# Altium project BrainBoardProject.PrjPcb
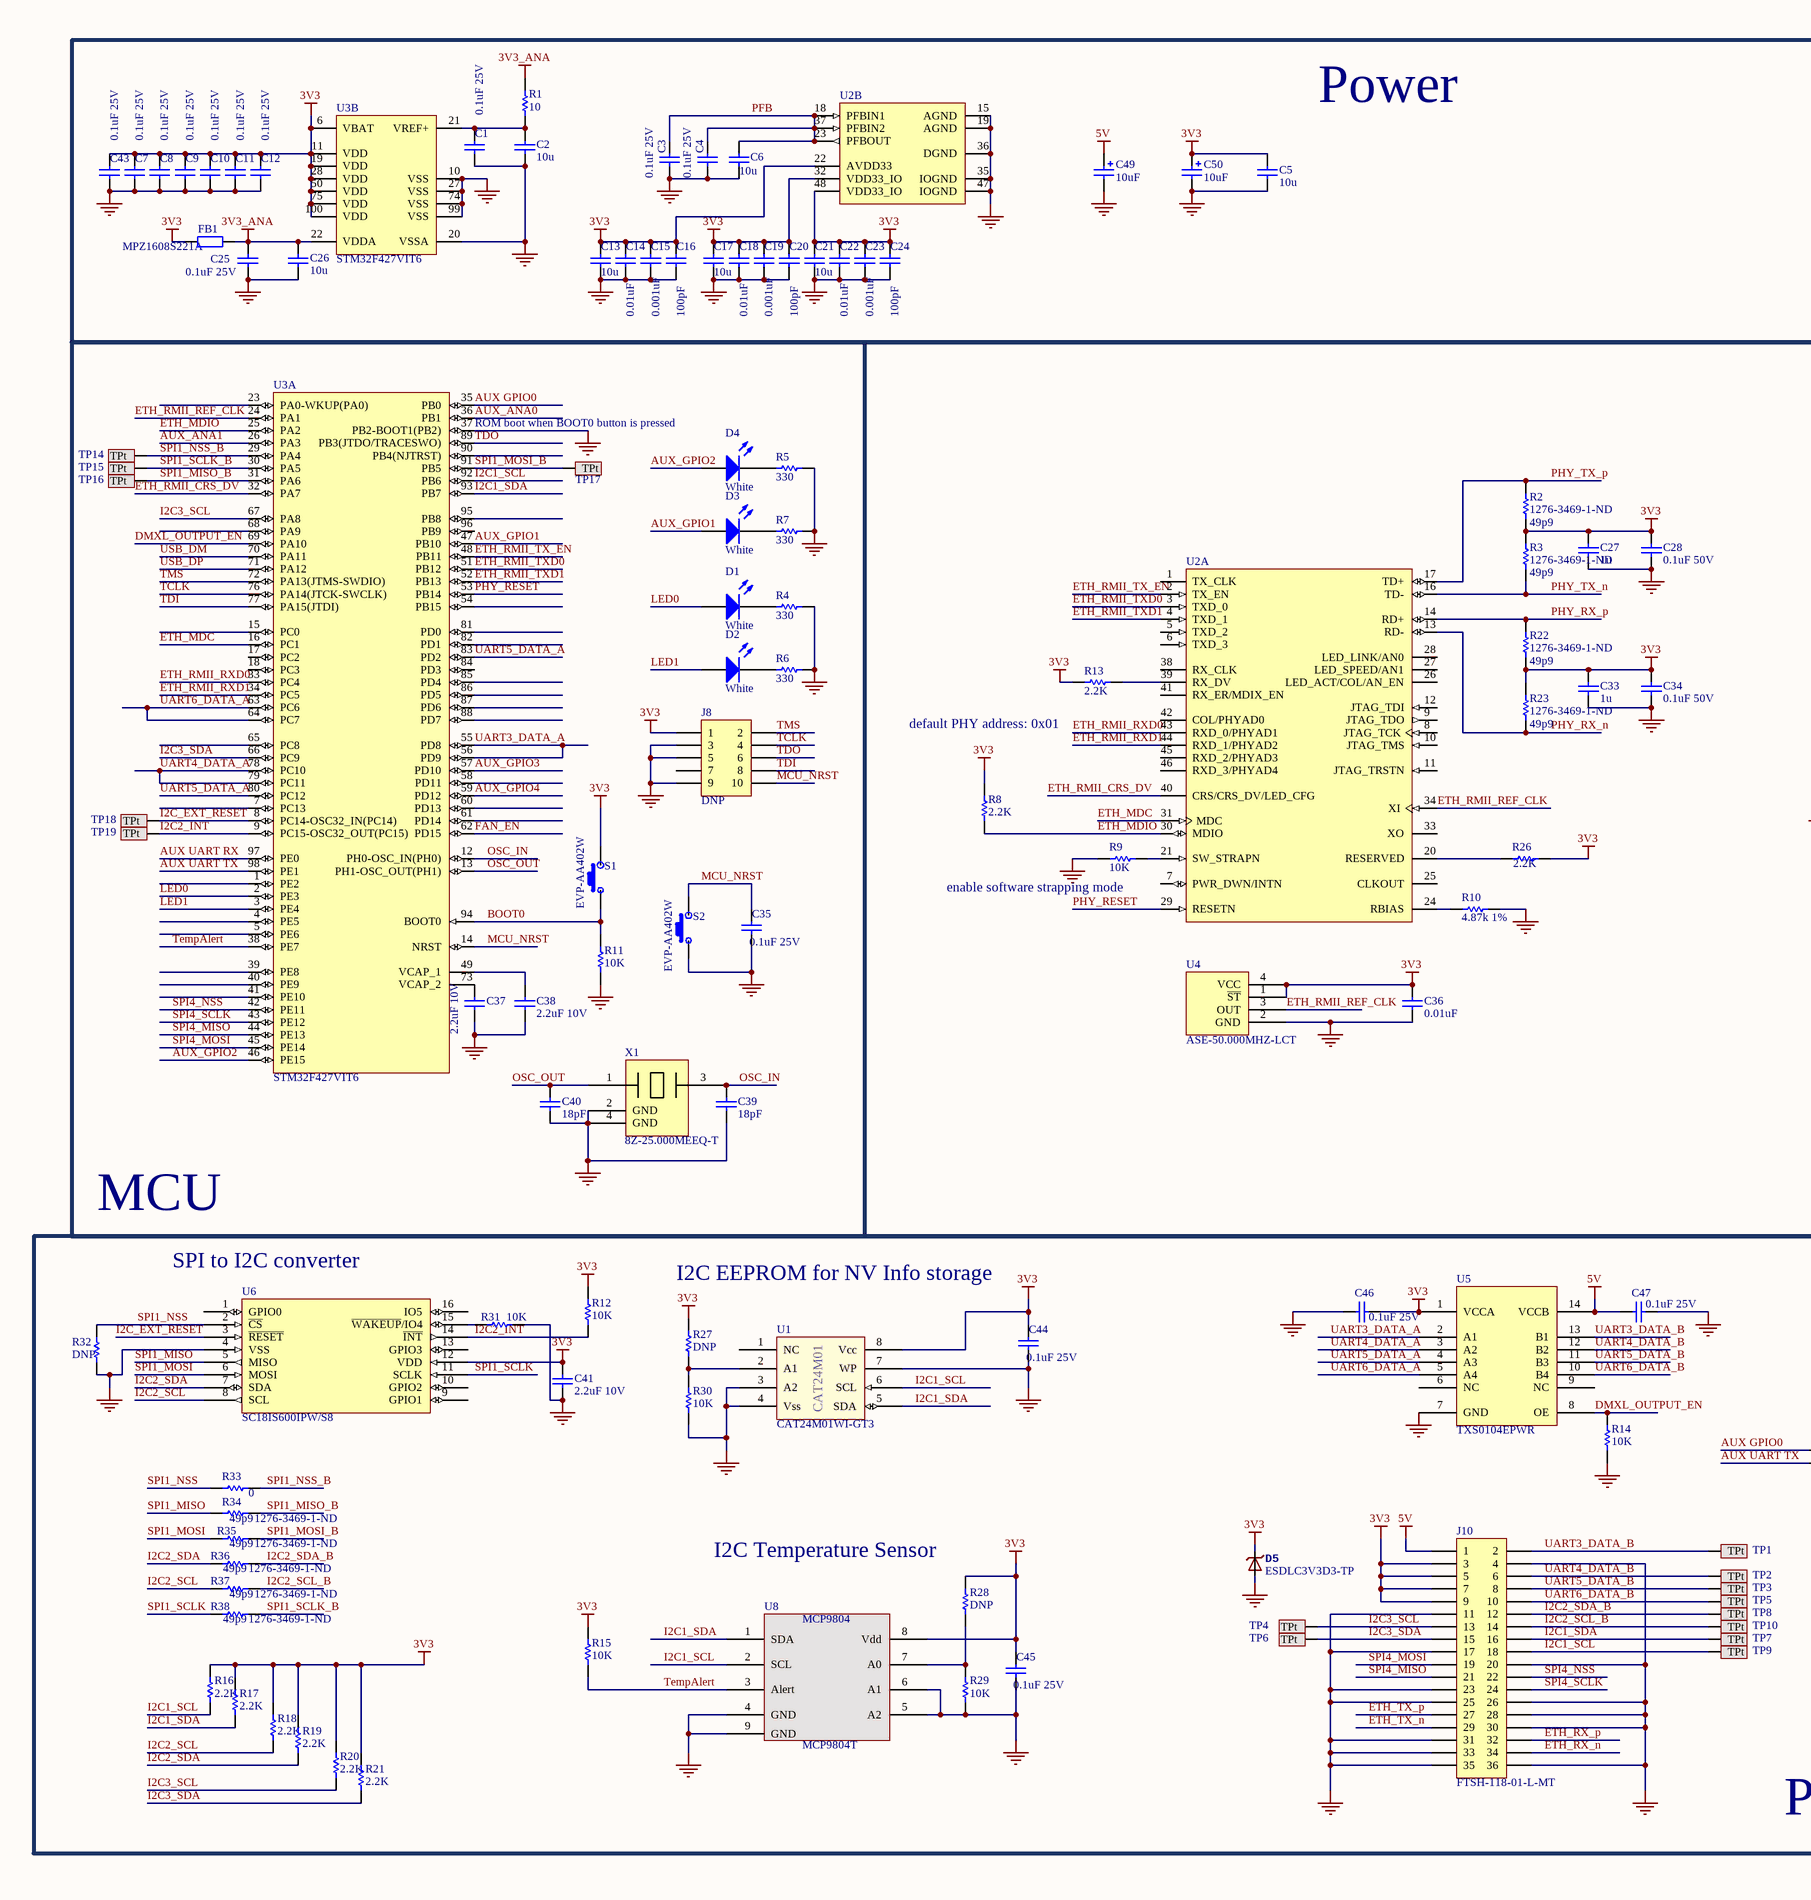
[diagram p0: reflex_brainboard_RevG.SchDoc, left]
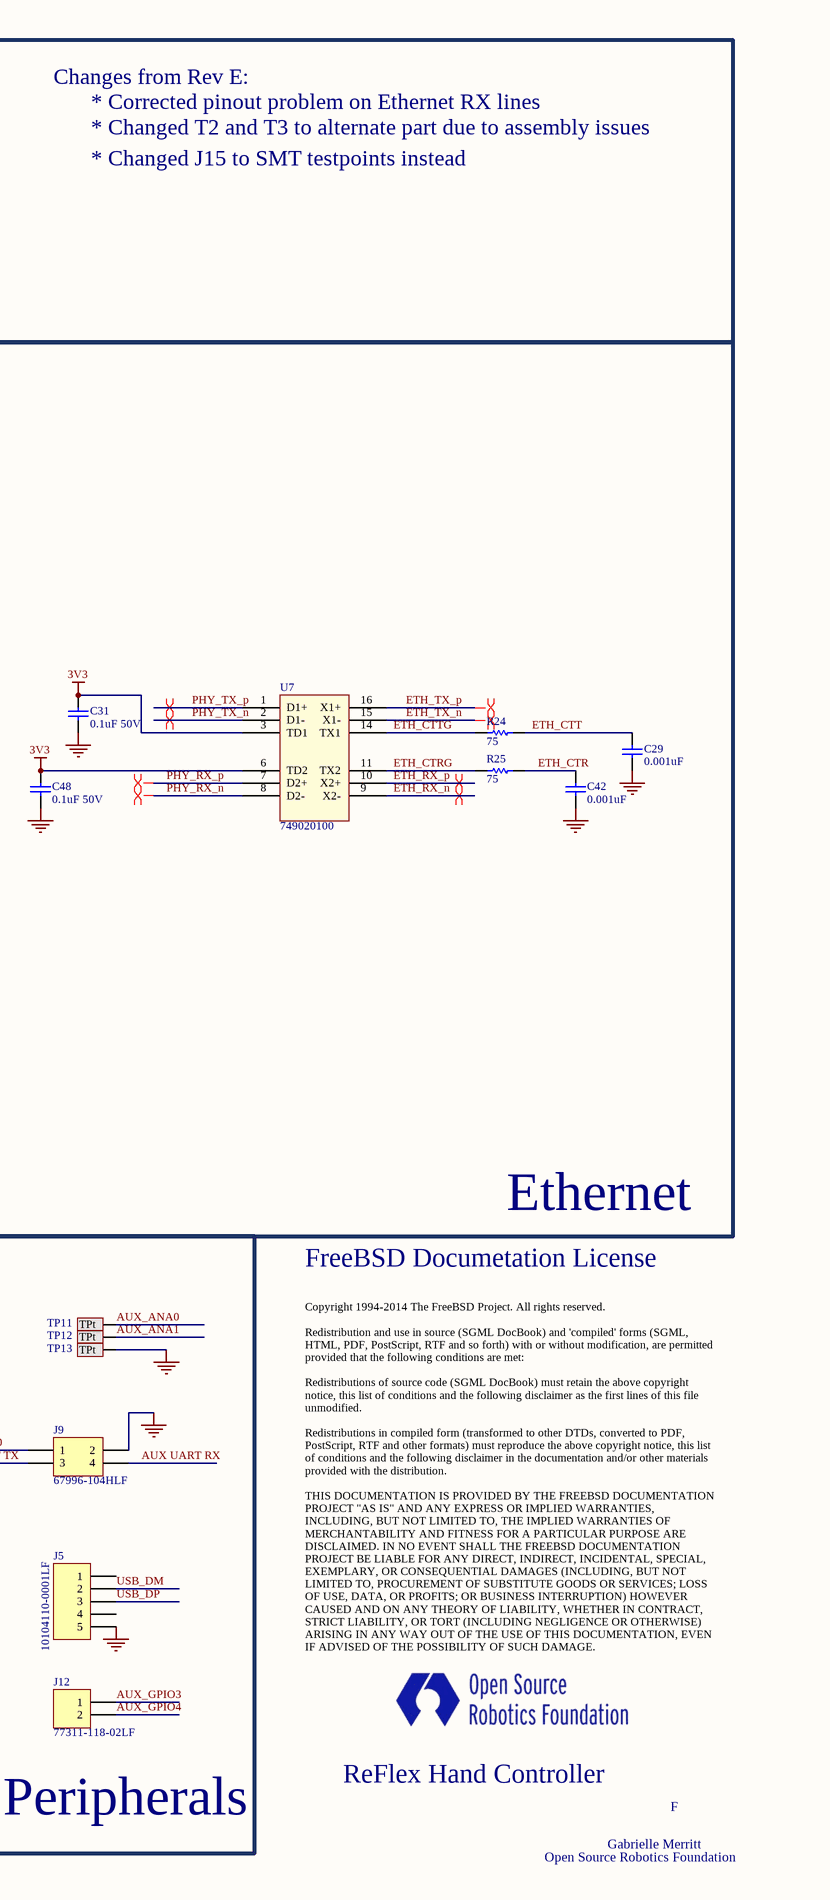
[diagram p1: reflex_brainboard_RevG.SchDoc, right]
1 sheet, 127 parts. Net scope: global (net labels, ports and power ports of the same name join across sheets).
Board file: reflex_brainboard_RevG.PcbDoc

## Sheet reflex_brainboard_RevG.SchDoc
size C; PageSetup: Record=PageOptions|CenterHorizontal=True|CenterVertical=True|PrintScale=0.53|XCorrection=1.00|YCorrection=1.00|PrintKind=0|BorderSize=5000000|LeftOffset=0|BottomOffset=0|Orientation=2|PaperLength=1000|PaperWidth=1000|Scale=100|PaperSource=7|PrintQuality=-4|MediaType=1|DitherType=10|PrintScaleMode=1|PaperKind=Letter|PaperIndex=1

### Parts
C1  0.1uF 25V  [Generic_0603]
C2  value 10u  [GENERIC_0603]  (hidden comment: Cap_0603_10uF)
C3  0.1uF 25V  [Generic_0603]
C4  0.1uF 25V  [Generic_0603]
C5  value 10u  [GENERIC_0603]  (hidden comment: Cap_0603_10uF)
C6  value 10u  [GENERIC_0603]  (hidden comment: Cap_0603_10uF)
C7  0.1uF 25V  [Generic_0603]
C8  0.1uF 25V  [Generic_0603]
C9  0.1uF 25V  [Generic_0603]
C10  0.1uF 25V  [Generic_0603]
C11  0.1uF 25V  [Generic_0603]
C12  0.1uF 25V  [Generic_0603]
C13  value 10u  [GENERIC_0603]  (hidden comment: Cap_0603_10uF)
C14  0.01uF  [Generic_0402]
C15  0.001uF  [Generic_0402]
C16  100pF  [Generic_0402]
C17  value 10u  [GENERIC_0603]  (hidden comment: Cap_0603_10uF)
C18  0.01uF  [Generic_0402]
C19  0.001uF  [Generic_0402]
C20  100pF  [Generic_0402]
C21  value 10u  [GENERIC_0603]  (hidden comment: Cap_0603_10uF)
C22  0.01uF  [Generic_0402]
C23  0.001uF  [Generic_0402]
C24  100pF  [Generic_0402]
C25  0.1uF 25V  [Generic_0603]
C26  value 10u  [GENERIC_0603]  (hidden comment: Cap_0603_10uF)
C27  1u  [Generic_0402]
C28  value 0.1uF 50V  [Generic_0402]  (hidden comment: 0.1uF)
C29  0.001uF  [Generic_0402]
C31  value 0.1uF 50V  [Generic_0402]  (hidden comment: 0.1uF)
C33  1u  [Generic_0402]
C34  value 0.1uF 50V  [Generic_0402]  (hidden comment: 0.1uF)
C35  0.1uF 25V  [Generic_0603]
C36  0.01uF  [Generic_0402]
C37  2.2uF 10V  [Generic_0603]
C38  2.2uF 10V  [Generic_0603]
C39  18pF  [Generic_0402]
C40  18pF  [Generic_0402]
C41  2.2uF 10V  [Generic_0603]
C42  0.001uF  [Generic_0402]
C43  0.1uF 25V  [Generic_0603]
C44  0.1uF 25V  [Generic_0603]
C45  0.1uF 25V  [Generic_0603]
C46  0.1uF 25V  [Generic_0603]
C47  0.1uF 25V  [Generic_0603]
C48  value 0.1uF 50V  [Generic_0402]  (hidden comment: 0.1uF)
C49  10uF  [GENERIC_0805P]
C50  10uF  [GENERIC_0805P]
D1  value White  [0402_LED_WHITE]  (hidden comment: LED White)
D2  value White  [0402_LED_WHITE]  (hidden comment: LED White)
D3  value White  [0402_LED_WHITE]  (hidden comment: LED White)
D4  value White  [0402_LED_WHITE]  (hidden comment: LED White)
D5  ESDLC3V3D3-TP  [SOD-323]
FB1  MPZ1608S221A  [GENERIC_0603]
J5  10104110-0001LF  [FCI-10104110]
J8  DNP  [CNCTECH_3220-10-0300-00]
J9  67996-104HLF  [HDR2X2]
J10  FTSH-118-01-L-MT  [FTSH-118-01-L-MT]
J12  77311-118-02LF  [HDR1X2]
R1  10  [Generic_0402]
R2  value 49p9  Supplier Part Number 1: 1276-3469-1-ND  [Generic_0402]  (hidden comment: Res_0402_49p9_1pct)
R3  value 49p9  Supplier Part Number 1: 1276-3469-1-ND  [Generic_0402]  (hidden comment: Res_0402_49p9_1pct)
R4  330  [Generic_0402]
R5  330  [Generic_0402]
R6  330  [Generic_0402]
R7  330  [Generic_0402]
R8  value 2.2K  [Generic_0402]  (hidden comment: Res_0402_2.2K)
R9  value 10K  [Generic_0402]  (hidden comment: Res_0402_10K_1pct)
R10  4.87k 1%  [Generic_0402]
R11  value 10K  [Generic_0402]  (hidden comment: Res_0402_10K_1pct)
R12  value 10K  [Generic_0402]  (hidden comment: Res_0402_10K_1pct)
R13  value 2.2K  [Generic_0402]  (hidden comment: Res_0402_2.2K)
R14  value 10K  [Generic_0402]  (hidden comment: Res_0402_10K_1pct)
R15  value 10K  [Generic_0402]  (hidden comment: Res_0402_10K_1pct)
R16  value 2.2K  [Generic_0402]  (hidden comment: Res_0402_2.2K)
R17  value 2.2K  [Generic_0402]  (hidden comment: Res_0402_2.2K)
R18  value 2.2K  [Generic_0402]  (hidden comment: Res_0402_2.2K)
R19  value 2.2K  [Generic_0402]  (hidden comment: Res_0402_2.2K)
R20  value 2.2K  [Generic_0402]  (hidden comment: Res_0402_2.2K)
R21  value 2.2K  [Generic_0402]  (hidden comment: Res_0402_2.2K)
R22  value 49p9  Supplier Part Number 1: 1276-3469-1-ND  [Generic_0402]  (hidden comment: Res_0402_49p9_1pct)
R23  value 49p9  Supplier Part Number 1: 1276-3469-1-ND  [Generic_0402]  (hidden comment: Res_0402_49p9_1pct)
R24  75  [Generic_0402]
R25  75  [Generic_0402]
R26  value 2.2K  [Generic_0402]  (hidden comment: Res_0402_2.2K)
R27  value DNP  [Generic_0402]  (hidden comment: Res_0402_DNP)
R28  value DNP  [Generic_0402]  (hidden comment: Res_0402_DNP)
R29  value 10K  [Generic_0402]  (hidden comment: Res_0402_10K_1pct)
R30  value 10K  [Generic_0402]  (hidden comment: Res_0402_10K_1pct)
R31  value 10K  [Generic_0402]  (hidden comment: Res_0402_10K_1pct)
R32  value DNP  [Generic_0402]  (hidden comment: Res_0402_DNP)
R33  value 0  [GENERIC_0402]  (hidden comment: Res_0402_0)
R34  value 49p9  Supplier Part Number 1: 1276-3469-1-ND  [Generic_0402]  (hidden comment: Res_0402_49p9_1pct)
R35  value 49p9  Supplier Part Number 1: 1276-3469-1-ND  [Generic_0402]  (hidden comment: Res_0402_49p9_1pct)
R36  value 49p9  Supplier Part Number 1: 1276-3469-1-ND  [Generic_0402]  (hidden comment: Res_0402_49p9_1pct)
R37  value 49p9  Supplier Part Number 1: 1276-3469-1-ND  [Generic_0402]  (hidden comment: Res_0402_49p9_1pct)
R38  value 49p9  Supplier Part Number 1: 1276-3469-1-ND  [Generic_0402]  (hidden comment: Res_0402_49p9_1pct)
S1  EVP-AA402W  [EVPAA402_switch]
S2  EVP-AA402W  [EVPAA402_switch]
TP1  SMT Pad  [TP_PAD_20mil]  (value not drawn)
TP2  SMT Pad  [TP_PAD_20mil]  (value not drawn)
TP3  SMT Pad  [TP_PAD_20mil]  (value not drawn)
TP4  SMT Pad  [TP_PAD_20mil]  (value not drawn)
TP5  SMT Pad  [TP_PAD_20mil]  (value not drawn)
TP6  SMT Pad  [TP_PAD_20mil]  (value not drawn)
TP7  SMT Pad  [TP_PAD_20mil]  (value not drawn)
TP8  SMT Pad  [TP_PAD_20mil]  (value not drawn)
TP9  SMT Pad  [TP_PAD_20mil]  (value not drawn)
TP10  SMT Pad  [TP_PAD_20mil]  (value not drawn)
TP11  SMT Pad  [TP_PAD_20mil]  (value not drawn)
TP12  SMT Pad  [TP_PAD_20mil]  (value not drawn)
TP13  SMT Pad  [TP_PAD_20mil]  (value not drawn)
TP14  SMT Pad  [TP_PAD_20mil]  (value not drawn)
TP15  SMT Pad  [TP_PAD_20mil]  (value not drawn)
TP16  SMT Pad  [TP_PAD_20mil]  (value not drawn)
TP17  SMT Pad  [TP_PAD_20mil]  (value not drawn)
TP18  SMT Pad  [TP_PAD_20mil]  (value not drawn)
TP19  SMT Pad  [TP_PAD_20mil]  (value not drawn)
U1  CAT24M01WI-GT3  [SOIC8]
U2  TLK110PT  [PT0048A_M]  (value not drawn)  (parts A,B of 2)
U3  STM32F427VIT6  [STM-LQFP100_N]  (parts A,B of 2)
U4  ASE-50.000MHZ-LCT  [OSCILLATOR_3.2x2.5]
U5  TXS0104EPWR  [TXS0104EPWR]
U6  SC18IS600IPW/S8  [SOT403-1-TSSOP16]
U7  749020100  [Wurth749020100]
U8  MCP9804T  [Temp_MCP9804T]
X1  8Z-25.000MEEQ-T  [CRYSTAL_2_2.5]

### Blocks framed on the sheet
Power: C1-C26 C43 C49 C50 FB1 R1 U2 U3
Ethernet: C27-C29 C31 C33 C34 C36 C42 C48 R2 R3 R8-R10 R13 R22-R26 U2 U4 U7
MCU: C35 C37-C40 D1-D4 J8 R4-R7 R11 S1 S2 TP14-TP19 U3 X1
Peripherals: C41 C44-C47 D5 J5 J9 J10 J12 R12 R14-R21 R27-R38 TP1-TP13 U1 U5 U6 U8

### Nets
3V3: C5.2 C7.2 C8.2 C9.2 C10.2 C11.2 C12.2 C13.2 C14.2 C15.2 C16.2 C17.2 C18.2 C19.2 C20.2 C21.2 C22.2 C23.2 C24.2 C27.2 C28.2 C31.2 C33.2 C34.2 C36.2 C41.2 C43.2 C44.2 C45.2 C46.1 C48.2 C50.1 D5.1(A) FB1.1 J8.1 J10.3 J10.5 J10.7 J10.9 R2.2 R3.2 R8.1 R12.2 R13.2 R15.2 R16.2 R17.2 R18.2 R19.2 R20.2 R21.2 R22.1 R23.2 R26.2 R27.2 R28.2 S1.1 U1.8(Vcc) U2.22(AVDD33) U2.32(VDD33_IO) U2.48(VDD33_IO) U3.6(VBAT) U3.11(VDD) U3.19(VDD) U3.28(VDD) U3.50(VDD) U3.75(VDD) U3.100(VDD) U4.1(~{ST}) U4.4(VCC) U5.1(VCCA) U6.12(VDD) U7.3(TD1) U7.6(TD2) U8.8(Vdd)
3V3_ANA: C25.2 C26.2 FB1.2 R1.2 U3.22(VDDA)
5V: C47.2 C49.1 J10.1 U5.14(VCCB)
GND: C1.1 C2.1 C3.2 C4.1 C5.1 C6.1 C7.1 C8.1 C9.1 C10.1 C11.1 C12.1 C13.1 C14.1 C15.1 C16.1 C17.1 C18.1 C19.1 C20.1 C21.1 C22.1 C23.1 C24.1 C25.1 C26.1 C27.1 C28.1 C29.1 C31.1 C33.1 C34.1 C35.1 C36.1 C37.1 C38.1 C39.2 C40.2 C41.1 C42.1 C43.1 C44.1 C45.1 C46.2 C47.1 C48.1 C49.2 C50.2 D5.2(C) J5.5 J8.3 J8.5 J8.9 J9.2 J10.4 J10.11 J10.17 J10.20 J10.23 J10.25 J10.26 J10.28 J10.30 J10.31 J10.33 J10.35 J10.36 R4.1 R5.1 R6.1 R7.1 R9.1 R10.1 R11.1 R14.1 R29.1 R30.1 R31.1 R32.2 S2.2 TP13.1(TPt) U1.3(A2) U1.4(Vss) U1.7(WP) U2.15(AGND) U2.19(AGND) U2.35(IOGND) U2.36(DGND) U2.47(IOGND) U3.10(VSS) U3.20(VSSA) U3.27(VSS) U3.37(PB2-BOOT1(PB2)) U3.74(VSS) U3.99(VSS) U4.2(GND) U5.7(GND) U6.4(VSS) U8.4(GND) U8.5(A2) U8.6(A1) U8.9(GND) X1.2(GND) X1.4(GND)
AUX GPIO0: J9.1 U3.35(PB0)
AUX UART RX: J9.4 U3.97(PE0)
AUX UART TX: J9.3 U3.98(PE1)
AUX_ANA0: TP11.1(TPt) U3.36(PB1)
AUX_ANA1: TP12.1(TPt) U3.26(PA3)
AUX_GPIO1: D3.1(A) U3.47(PB10)
AUX_GPIO2: D4.1(A) U3.46(PE15)
AUX_GPIO3: J12.1 U3.57(PD10)
AUX_GPIO4: J12.2 U3.59(PD12)
BOOT0: R11.2 S1.2 U3.94(BOOT0)
DMXL_OUTPUT_EN: R14.2 U3.69(PA10) U5.8(OE)
ETH_CTR: C42.2 R25.2
ETH_CTRG: R25.1 U7.11(TX2)
ETH_CTT: C29.2 R24.2
ETH_CTTG: R24.1 U7.14(TX1)
ETH_MDC: U2.31(MDC) U3.16(PC1)
ETH_MDIO: R8.2 U2.30(MDIO) U3.25(PA2)
ETH_RMII_CRS_DV: U2.40(CRS/CRS_DV/LED_CFG) U3.32(PA7)
ETH_RMII_REF_CLK: U2.34(XI) U3.24(PA1) U4.3(OUT)
ETH_RMII_RXD0: U2.43(RXD_0/PHYAD1) U3.33(PC4)
ETH_RMII_RXD1: U2.44(RXD_1/PHYAD2) U3.34(PC5)
ETH_RMII_TX_EN: U2.2(TX_EN) U3.48(PB11)
ETH_RMII_TXD0: U2.3(TXD_0) U3.51(PB12)
ETH_RMII_TXD1: U2.4(TXD_1) U3.52(PB13)
ETH_RX_n: J10.34 U7.9(X2-)
ETH_RX_p: J10.32 U7.10(X2+)
ETH_TX_n: J10.29 U7.15(X1-)
ETH_TX_p: J10.27 U7.16(X1+)
FAN_EN: U3.62(PD15)
I2C1_SCL: J10.18 R16.1 TP9.1(TPt) U1.6(SCL) U3.92(PB6) U8.2(SCL)
I2C1_SDA: J10.16 R17.1 TP7.1(TPt) U1.5(SDA) U3.93(PB7) U8.1(SDA)
I2C2_INT: R12.1 TP19.1(TPt) U3.9(PC15-OSC32_OUT(PC15)) U6.14(~{INT})
I2C2_SCL: R18.1 R37.2 U6.8(SCL)
I2C2_SCL_B: J10.14 R37.1 TP10.1(TPt)
I2C2_SDA: R19.1 R36.2 U6.7(SDA)
I2C2_SDA_B: J10.12 R36.1 TP8.1(TPt)
I2C3_SCL: J10.13 R20.1 TP4.1(TPt) U3.67(PA8)
I2C3_SDA: J10.15 R21.1 TP6.1(TPt) U3.66(PC9)
I2C_EXT_~{RESE}T: TP18.1(TPt) U3.8(PC14-OSC32_IN(PC14)) U6.3(~{RESET})
LED0: D1.1(A) U3.2(PE3)
LED1: D2.1(A) U3.3(PE4)
MCU_NRST: C35.2 J8.10 S2.1 U3.14(NRST)
OSC_IN: C39.1 U3.12(PH0-OSC_IN(PH0)) X1.3
OSC_OUT: C40.1 U3.13(PH1-OSC_OUT(PH1)) X1.1
PFB: C3.1 C4.2 C6.2 U2.18(PFBIN1) U2.23(PFBOUT) U2.37(PFBIN2)
PHY_RESET: U2.29(RESETN) U3.53(PB14)
PHY_RX_n: R23.1 U2.13(RD-) U7.8(D2-)
PHY_RX_p: R22.2 U2.14(RD+) U7.7(D2+)
PHY_TX_n: R3.1 U2.16(TD-) U7.2(D1-)
PHY_TX_p: R2.1 U2.17(TD+) U7.1(D1+)
SPI1_MISO: R34.2 U6.5(MISO)
SPI1_MISO_B: R34.1 TP16.1(TPt) U3.31(PA6)
SPI1_MOSI: R35.2 U6.6(MOSI)
SPI1_MOSI_B: R35.1 TP17.1(TPt) U3.91(PB5)
SPI1_NSS: R32.1 R33.2 U6.2(~{CS})
SPI1_NSS_B: R33.1 TP14.1(TPt) U3.29(PA4)
SPI1_SCLK: R38.2 U6.11(SCLK)
SPI1_SCLK_B: R38.1 TP15.1(TPt) U3.30(PA5)
SPI4_MISO: J10.21 U3.44(PE13)
SPI4_MOSI: J10.19 U3.45(PE14)
SPI4_NSS: J10.22 U3.42(PE11)
SPI4_SCLK: J10.24 U3.43(PE12)
TCLK: J8.4 U3.76(PA14(JTCK-SWCLK))
TDI: J8.8 U3.77(PA15(JTDI))
TDO: J8.6 U3.89(PB3(JTDO/TRACESWO))
TempAlert: R15.1 U3.38(PE7) U8.3(Alert)
TMS: J8.2 U3.72(PA13(JTMS-SWDIO))
UART3_DATA_A: U3.55(PD8) U3.56(PD9) U5.2(A1)
UART3_DATA_B: J10.2 TP1.1(TPt) U5.13(B1)
UART4_DATA_A: U3.78(PC10) U3.79(PC11) U5.3(A2)
UART4_DATA_B: J10.6 TP2.1(TPt) U5.12(B2)
UART5_DATA_A: U3.80(PC12) U3.83(PD2) U5.4(A3)
UART5_DATA_B: J10.8 TP3.1(TPt) U5.11(B3)
UART6_DATA_A: U3.63(PC6) U3.64(PC7) U5.5(A4)
UART6_DATA_B: J10.10 TP5.1(TPt) U5.10(B4)
USB_DM: J5.2 U3.70(PA11)
USB_DP: J5.3 U3.71(PA12)
NetC1_2: C1.2 C2.2 R1.1 U3.21(VREF+)
NetC37_2: C37.2 U3.73(VCAP_2)
NetC38_2: C38.2 U3.49(VCAP_1)
NetD1_2: D1.2(K) R4.2
NetD2_2: D2.2(K) R6.2
NetD3_2: D3.2(K) R7.2
NetD4_2: D4.2(K) R5.2
NetR9_2: R9.2 U2.21(SW_STRAPN)
NetR10_2: R10.2 U2.24(RBIAS)
NetR13_1: R13.1 U2.39(RX_DV)
NetR26_1: R26.1 U2.20(RESERVED)
NetR27_1: R27.1 R30.2 U1.2(A1)
NetR28_1: R28.1 R29.2 U8.7(A0)
NetR31_2: R31.2 U6.15(~{WAKEUP}/IO4)

Not connected (* = marked no-connect by the designer): J5 1 4; J8 7; U1 1(NC); U2 1(TX_CLK) 5(TXD_2) 6(TXD_3) 7(PWR_DWN/INTN) 8(JTAG_TCK) 9(JTAG_TDO) 10(JTAG_TMS) 11(JTAG_TRSTN) 12(JTAG_TDI) 25(CLKOUT) 26(LED_ACT/COL/AN_EN) 27(LED_SPEED/AN1) 28(LED_LINK/AN0) 33(XO) 38(RX_CLK) 41(RX_ER/MDIX_EN) 42(COL/PHYAD0) 45(RXD_2/PHYAD3) 46(RXD_3/PHYAD4); U3 1(PE2) 4(PE5) 5(PE6) 7(PC13) 15(PC0) 17(PC2) 18(PC3) 23(PA0-WKUP(PA0)) 39(PE8) 40(PE9) 41(PE10) 54(PB15) 58(PD11) 60(PD13) 61(PD14) 65(PC8) 68(PA9) 81(PD0) 82(PD1) 84(PD3) 85(PD4) 86(PD5) 87(PD6) 88(PD7) 90(PB4(NJTRST)) 95(PB8) 96(PB9); U5 6(NC) 9(NC); U6 1(GPIO0) 9(GPIO1) 10(GPIO2) 13(GPIO3) 16(IO5)

### Layout directives
differential pair: ETH_RX_n, ETH_RX_p, ETH_TX_n, ETH_TX_p, PHY_RX_n, PHY_RX_p, PHY_TX_n, PHY_TX_p

### Notes on the sheet
- Changes from Rev E:
- * Corrected pinout problem on Ethernet RX lines
- * Changed T2 and T3 to alternate part due to assembly issues
- * Changed J15 to SMT testpoints instead
- ROM boot when BOOT0 button is pressed
- (near R13) default PHY address: 0x01
- enable software strapping mode
- (near U6) SPI to I2C converter
- I2C EEPROM for NV Info storage
- FreeBSD Documetation License
- (near R28) I2C Temperature Sensor
- Copyright 1994-2014 The FreeBSD Project. All rights reserved.
  Redistribution and use in source (SGML DocBook) and 'compiled' forms (SGML, HTML, PDF, PostScript, RTF and so forth) with or without modification, are permitted provided that the following conditions are met:
  Redistributions of source code (SGML DocBook) must retain the above copyright notice, this list of conditions and the following disclaimer as the first lines of this file unmodified.
  Redistributions in compiled form (transformed to other DTDs, converted to PDF, PostScript, RTF and other formats) must reproduce the above copyright notice, this list of conditions and the following disclaimer in the documentation and/or other materials provided with the distribution.
  THIS DOCUMENTATION IS PROVIDED BY THE FREEBSD DOCUMENTATION PROJECT "AS IS" AND ANY EXPRESS OR IMPLIED WARRANTIES, INCLUDING, BUT NOT LIMITED TO, THE IMPLIED WARRANTIES OF MERCHANTABILITY AND FITNESS FOR A PARTICULAR PURPOSE ARE DISCLAIMED. IN NO EVENT SHALL THE FREEBSD DOCUMENTATION PROJECT BE LIABLE FOR ANY DIRECT, INDIRECT, INCIDENTAL, SPECIAL, EXEMPLARY, OR CONSEQUENTIAL DAMAGES (INCLUDING, BUT NOT LIMITED TO, PROCUREMENT OF SUBSTITUTE GOODS OR SERVICES; LOSS OF USE, DATA, OR PROFITS; OR BUSINESS INTERRUPTION) HOWEVER CAUSED AND ON ANY THEORY OF LIABILITY, WHETHER IN CONTRACT, STRICT LIABILITY, OR TORT (INCLUDING NEGLIGENCE OR OTHERWISE) ARISING IN ANY WAY OUT OF THE USE OF THIS DOCUMENTATION, EVEN IF ADVISED OF THE POSSIBILITY OF SUCH DAMAGE.
- ReFlex Hand Controller
- Gabrielle Merritt
- F
- Open Source Robotics Foundation
- (in symbol IC_EEPROM_I2C_1Mbit) CAT24M01
- (in symbol IC_Temp_Sensor_MCP9804_I2C) MCP9804

### Library data of the parts
C1 C3 C4 C7-C12 C25 C35 C43-C47 = Cap_0603_0.1uF_25V: Capacitor 0.1uF 0603 package; Supplier 1: Digi-Key; Supplier Part Number 1: 478-1244-1-ND; Supplier Unit Price 1: 0.38; Supplier Unit Price 2: 0.13; Value: 0.1uF 25V
C2 C5 C6 C13 C17 C21 C26 = Cap_0603_10uF: Capacitor; Manufacturer: TDK Corporation; Manufacturer Part Number: C1608X5R1E106M080AC; Case-EIA: 0603; PackageReference: 0603; Mouser: 810-C1608X5R1E106M; Supplier 1: Digi-Key; Supplier 2: Mouser; Supplier Part Number 1: 445-9015-1-ND; Supplier Part Number 2: 810-C1608X5R1E106M
C14 C18 C22 C36 = Cap_0402_0p01uF: Capacitor 0.01uF 0402 package; Supplier 1: Digi-Key; Supplier Part Number 1: 445-1262-1-ND; Supplier Unit Price 1: 0.018; Supplier Unit Price 2: 0.006; Value: 0.01uF
C15 C19 C23 C29 C42 = Cap_0402_0p001uF: Capacitor 0.001uF 0402 package; Supplier 1: Digi-Key; Supplier 2: Newark; Supplier Part Number 1: 311-1036-1-ND; Supplier Part Number 2: 74C3082; Value: 0.001uF
C16 C20 C24 = Cap_0402_100pF: Capacitor 100pF 0402 package; Supplier 1: Digi-Key; Supplier Part Number 1: 490-3458-1-ND; Supplier Unit Price 1: 0.01; Supplier Unit Price 2: 0.00526; Value: 100pF
C27 C33 = Cap_0402_1uF: Capacitor; Supplier 1: Digi-Key; Supplier 2: Mouser; Supplier Part Number 1: 445-4978-1-ND; Supplier Part Number 2: 810-C1005X5R1C105K; Value: 1u
C28 C31 C34 C48 = Cap_0402_0p1uF_50V: Capacitor 0.1uF 0402 package; Supplier 1: Digi-Key; Supplier 2: Newark; Supplier Part Number 1: 445-5933-1-ND; Supplier Part Number 2: 12T1864
C37 C38 C41 = Cap_0603_2p2uF_10V: Capacitor 2.2uF 0603 package; Supplier 1: Digi-Key; Supplier 2: Newark; Supplier Part Number 1: 587-1253-1-ND; Supplier Part Number 2: 18J2716; Value: 2.2uF 10V
C39 C40 = Cap_0402_18pF: Capacitor 18pF 0402 package; Supplier 1: Digi-Key; Supplier Part Number 1: 712-1264-1-ND; Value: 18pF
C49 C50 = Cap 0805P_10uF: Polarized Capacitor (Radial); Supplier 1: Digi-Key; Supplier 2: Mouser; Supplier Part Number 1: 445-14388-1-ND; Supplier Part Number 2: 810-C2012X5R1E106MAC; Value: 10uF
D1-D4 = LED_White_0402: Surface mount LEDs; Supplier 1: Digi-Key; Supplier Part Number 1: 511-1616-1-ND; Supplier Unit Price 1: 2.01; Supplier Unit Price 2: 0.66
D5 = Diode_ESDLC3V3D3-TP: Manufacturer: Micro Commercial Co; Supplier 1: Digi-Key; Supplier 2: Mouser; Supplier Part Number 1: ESDLC3V3D3-TPMSCT-ND; Supplier Part Number 2: 833-ESDLC3V3D3-TP; Value: ESDLC3V3D3-TP
FB1 = FerriteBead: Ferrite Bead; Manufacturer: TDK Corporation; PackageReference: 0603; Manufacturer Part Number: MPZ1608S221A; Mouser: 810-MPZ1608S221A; Supplier 1: Digi-Key; Supplier 2: Mouser; Supplier Part Number 1: 445-172893-1-ND; Supplier Part Number 2: 810-MPZ1608S221A; Value: MPZ1608S221A
J5 = Conn_USB_Micro: USB Micro Connector; Supplier 1: Digi-Key; Supplier Part Number 1: 609-4052-1-ND; Value: 10104110-0001LF
J8 = Header 5X2: Header, 5-Pin, Dual row; Supplier 1: Digi-Key; Supplier 2: Mouser; Supplier Part Number 1: 609-3729-ND; Supplier Part Number 2: 649-221121-00010T4LF; Value: DNP
J9 = Header 2X2: Header, 2-Pin, Dual row; Supplier 1: Digi-Key; Supplier 2: Mouser; Supplier Part Number 1: 609-3201-ND; Supplier Part Number 2: 649-67996-104H; Value: 67996-104HLF
J10 = Header 18X2 RA MT: Header, 18-Pin, Dual row, Hybrid SMT/Thru; Supplier 1: Digi-Key; Supplier Part Number 1: SAM1162-18-ND; Value: FTSH-118-01-L-MT
J12 = Header 2: Header, 2-Pin; Supplier 1: Digi-Key; Supplier 2: Mouser; Supplier Part Number 1: 609-4434-ND; Supplier Part Number 2: 649-77311-118-02LF; Value: 77311-118-02LF
R1 = Res_0402_10_1pct: Resistor  10 ohm; Supplier 1: Digi-Key; Supplier 2: Mouser; Supplier Part Number 1: P10.0LCT-ND; Supplier Part Number 2: 667-ERJ-2RKF10R0X; Value: 10
R2 R3 R22 R23 R34-R38 = Res_0402_49p9_1pct: Resistor 49.9 ohm; Supplier 1: Digi-Key
R4-R7 = Res_0402_330: RES 330 OHM 1/10W 1% 0402 SMD; Supplier 1: Digi-Key; Supplier 2: Newark; Supplier Part Number 1: P330LCT-ND; Supplier Part Number 2: 64R5277; Value: 330
R8 R13 R16-R21 R26 = Res_0402_2.2K: Resistor 2.2 Kohm; Supplier 1: Digi-Key; Supplier Part Number 1: P2.2KJCT-ND; Supplier Unit Price 1: 0.05; Supplier Unit Price 2: 0.0048
R9 R11 R12 R14 R15 R29-R31 = Res_0402_10K_1pct: Resistor 10 Kohm; Supplier 1: Digi-Key; Supplier 2: Newark; Supplier Part Number 1: P10.0KLCT-ND; Supplier Part Number 2: 64R5248
R10 = Res_0402_4p87K_1pct: 75R 0.063W 5% 0402 (1005 Metric)  SMD; Supplier 1: Digi-Key; Supplier 2: Mouser; Supplier Part Number 1: P4.87KLCT-ND; Supplier Part Number 2: 667-ERJ-2RKF4871X; Value: 4.87k 1%
R24 R25 = Res_0402_75_1pct: 75R 0.063W 5% 0402 (1005 Metric)  SMD; Supplier 1: Digi-Key; Value: 75; Supplier Part Number 1: 541-75.0LCT-ND
R27 R28 R32 = Res_0402_DNP: Resistor 0402 DNP
R33 = Res_0402_0: RES SMD 0 OHM JUMPER 1/10W 0402; Supplier 1: Digi-Key; Supplier Part Number 1: P0.0JCT-ND; Supplier Unit Price 1: 0.05; Supplier Unit Price 2: 0.0048
S1 S2 = Pushbutton_EVP-AA402W: Momentary Push button, NO; Supplier 1: Digi-Key; Supplier 2: Mouser; Supplier Part Number 1: P13349SCT-ND; Supplier Part Number 2: 667-EVP-AA402W; Value: EVP-AA402W
TP1-TP19 = TP_SMT_20mil: SMT pad for test
U1 = IC_EEPROM_I2C_1Mbit: I2C EEPROM 1Mbit; Supplier 1: Digi-Key; Supplier 2: Mouser; Supplier Part Number 1: CAT24M01WI-GT3OSCT-ND; Supplier Part Number 2: 863-CAT24M01WI-GT3; Value: CAT24M01WI-GT3
U2 = CMP-0302-00001-2: Industrial Temp, Single Port 10/100 Mb/s Ethernet Physical Layer Transceiver, -40 to 85 degC, 48-Pin LQFP (PT), Green (RoHS & no Sb/Br); SupplyVoltage(Volt): 3.3; Special Features: Cable Diagnostics; Interface: MII, RMII; LED(#): 3; Cable Length(m): 150; JTAG1149.1: Yes; SubFamily: PHY; DatasheetVersion: SLLS901A; ComponentLink2URL: http://www.ti.com/general/docs/lit/getliterature.tsp?genericPartNumber=TLK110&fileType=pdf; Port Count: Single; ComponentLink2Description: Datasheet; PackageVersion: revC, Nov-1996; PackageDescription: 48-Pin Plastic Quad Flat Pack, 7 x 7 mm Body, 0.5 mm Pitch; ComponentLink3Description: Package Specification; ComponentLink1Description: Manufacturer URL; ComponentLink3URL: http://www.ti.com/litv/pdf/mtqf003a; PackageReference: PT0048A; ComponentLink1URL: www.ti.com
U3 = MC-ARM-STM32F4X7-SQ100: ARM Cortex-M4 32-bit MCU+FPU, 210 DMIPS, 2048 kB Flash, 256 kB Internal RAM, 82 I/Os, 100-pin LQFP, -40 to 85 degC, Tray; Manufacturer: STMicroelectronics; D/A Converter: 2x12-bit; FLASH Size (Prog) (kB): 2048; I/Os (High Current): 82; Internal RAM Size (kB): 256; Supply Voltage(Vcc) min (V): 1.8; Supply Voltage(Vcc) max (V): 3.6; Operating Frequency(F) (Processor speed) (MHz): 168; Core: ARM Cortex-M4; Mounting Technology: Surface Mount; ComponentLink1URL: http://www.st.com/web/en/home.html; ComponentLink3Description: Package Specification; DatasheetVersion: Rev. 1; ComponentLink3URL: http://www.st.com/st-web-ui/static/active/en/resource/technical/document/data_brief/DM00071938.pdf; ComponentLink2Description: Datasheet; PartNumber: STM32F427VIT6; PackageReference: LQFP100; PackageVersion: Rev. 1, 06/2013; ComponentLink1Description: Manufacturer URL; ComponentLink2URL: http://www.st.com/st-web-ui/static/active/en/resource/technical/document/datasheet/DM00071990.pdf; Packing: Tray; PackageDescription: 100-Pin Low Profile Quad Flat Package, 14 x 14 mm Body, 0.5 mm Pitch; Manufacturer Part Number: STM32F427VIT6; Mouser: 511-STM32F427VIT6; Supplier 1: Digi-Key; Supplier 2: Mouser; Supplier Part Number 1: 497-14049-ND; Supplier Part Number 2: 511-STM32F427VIT6; Value: STM32F427VIT6
U4 = oscillator_3.2x2.5: Supplier 1: Digi-Key; Supplier 2: Mouser; Value: ASE-50.000MHZ-LCT; Supplier Part Number 1: 535-9577-1-ND; Supplier Part Number 2: 815-ASE-50.000MLCT
U5 = IC_LevelShifter_TXS0104EPWR: Level Shifter; Supplier 1: Digi-Key; Supplier 2: Mouser; Supplier Part Number 1: 296-20697-1-ND; Supplier Part Number 2: 595-TXS0104EPWR; Value: TXS0104EPWR
U6 = SC18IS600IPW/S8: SPI to I2C-bus interface
U7 = IC_EthernetMagnetics: Ethernet Magnetics Wurth 749020100; Supplier 1: Digi-Key; Supplier 2: Newark; Supplier Part Number 1: 732-3268-1-ND; Supplier Part Number 2: 08P2951; Value: 749020100
U8 = IC_Temp_Sensor_MCP9804_I2C: I2C Temp Sensor MCP9804T-E/MC; Supplier 1: Digi-Key; Supplier Part Number 1: MCP9804T-E/MCCT-ND; Value: MCP9804T
X1 = CRYSTAL: Supplier 1: Digi-Key; Supplier 2: Mouser; Supplier Part Number 1: 887-1339-1-ND; Supplier Part Number 2: 717-8Z-25.000MEEQ-T; Value: 8Z-25.000MEEQ-T